# EAGLE design EMF-1 (EAGLE 5.11)
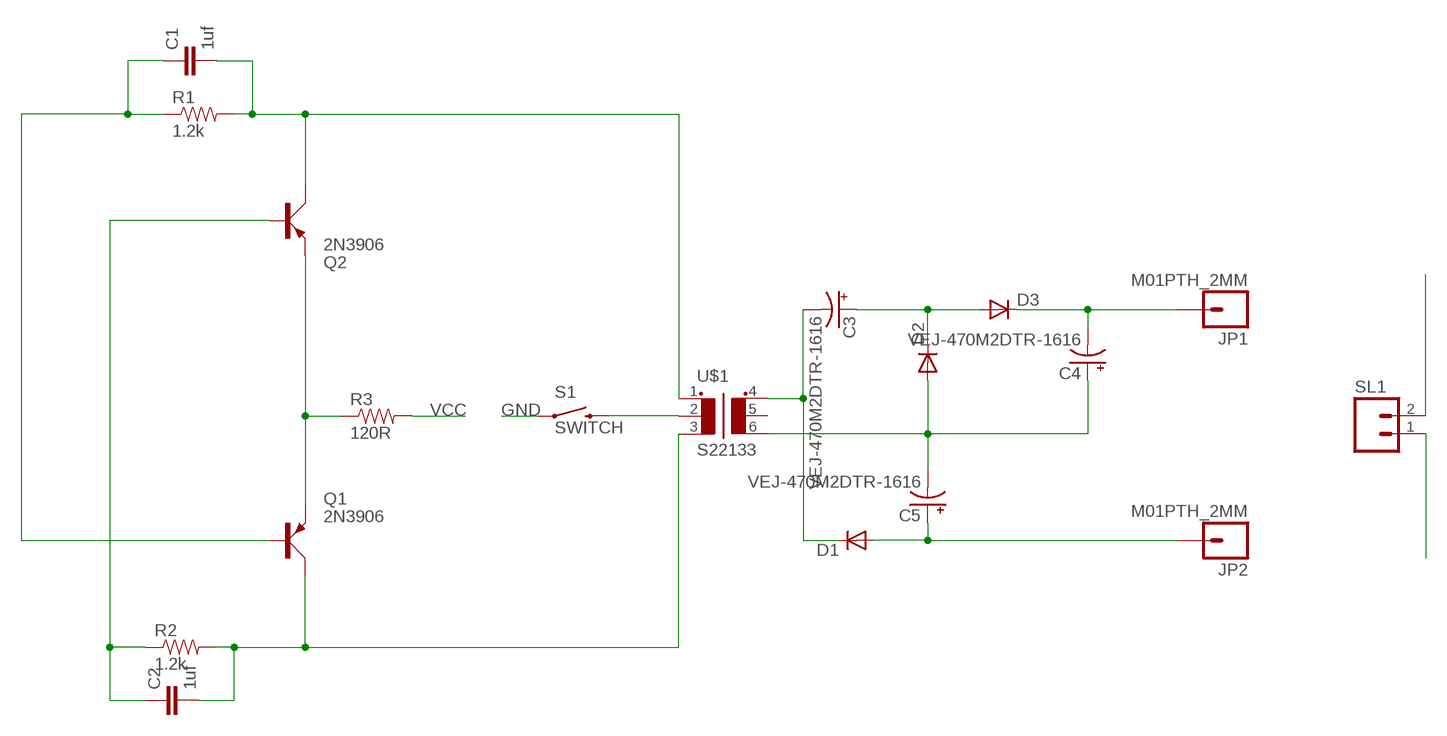
[diagram p0: schematic, sheet 1]

## Parts
C1  1uf  CAP0805  [0805]
C2  1uf  CAP0805  [0805]
C3  VEJ-470M2DTR-1616  CAP_POLPTH1  [CPOL-RADIAL-100UF-25V]
C4  VEJ-470M2DTR-1616  CAP_POLPTH1  [CPOL-RADIAL-100UF-25V]
C5  VEJ-470M2DTR-1616  CAP_POLPTH1  [CPOL-RADIAL-100UF-25V]
D1  DIODEHV  [DIODE-HV]
D2  DIODEHV  [DIODE-HV]
D3  DIODEHV  [DIODE-HV]
JP1  M01PTH_2MM  [1X01_2MM]
JP2  M01PTH_2MM  [1X01_2MM]
Q1  2N3906  [TO92D]
Q2  2N3906  [TO92D]
R1  1.2k  RESISTOR0805-RES  [0805]
R2  1.2k  RESISTOR0805-RES  [0805]
R3  120R  RESISTOR0805-RES  [0805]
S1  SWITCH  SWITCH-MOMENTARY-2PTH  [TACTILE-PTH]
SL1  M02  [02P]
U$1  S22133  [S22133]

## Nets
GND: S1.1 SL1.1
N$1: C1.1 Q1.B R1.1
N$2: C1.2 Q2.C R1.2 U$1.1
N$3: C2.2 Q1.C R2.2 U$1.3
N$4: C2.1 Q2.B R2.1
N$5: Q1.E Q2.E R3.1
N$6: S1.3 U$1.2
N$7: C3.2(-) D1.C U$1.4
N$8: C3.1(+) D2.C D3.A
N$9: C4.2(-) D3.C JP1.1
N$10: C4.1(+) C5.2(-) D2.A U$1.6
N$11: C5.1(+) D1.A JP2.1
VCC: R3.2 SL1.2
Unconnected: U$1.5

## Library data of the parts
C1 C2 = SparkFun:CAP: Capacitor Standard 0603 ceramic capacitor, and 0.1" leaded capacitor.
C3-C5 = SparkFun:CAP_POL: Capacitor Polarized These are standard SMD and PTH capacitors. Normally 10uF, 47uF, and 100uF in electrolytic and tantalum varieties. Always verify the external diameter of the through hole cap, it varies with capacity, voltage, and manufacturer. The EIA devices should be standard.
D1-D3 = SparkFun:DIODE: Diode These are standard reverse protection diodes and small signal diodes. SMA package can handle up to about 1A. SOD-323 can handle about 200mA. What the SOD-323 package when ordering, there are some mfgs out there that are 5-pin packages.
JP1 JP2 = SparkFun:M01: Header 1 Standard 1-pin 0.1" header. Use with straight break away headers (SKU : PRT-00116), right angle break away headers (PRT-00553), swiss pins (PRT-00743), machine pins (PRT-00117), and female headers (PRT-00115).
Q1 Q2 = transistor-small-signal:2N3906: PNP TRANSISTOR
R1-R3 = SparkFun:RESISTOR: Resistor Basic schematic elements and footprints for 0603, 1206, and PTH resistors.
S1 = SparkFun:SWITCH-MOMENTARY-2
SL1 = con-amp-quick:M02: AMP QUICK CONNECTOR; OC_FARNELL: unknown; OC_NEWARK: unknown
U$1 = EMF-1:S22133

## Board
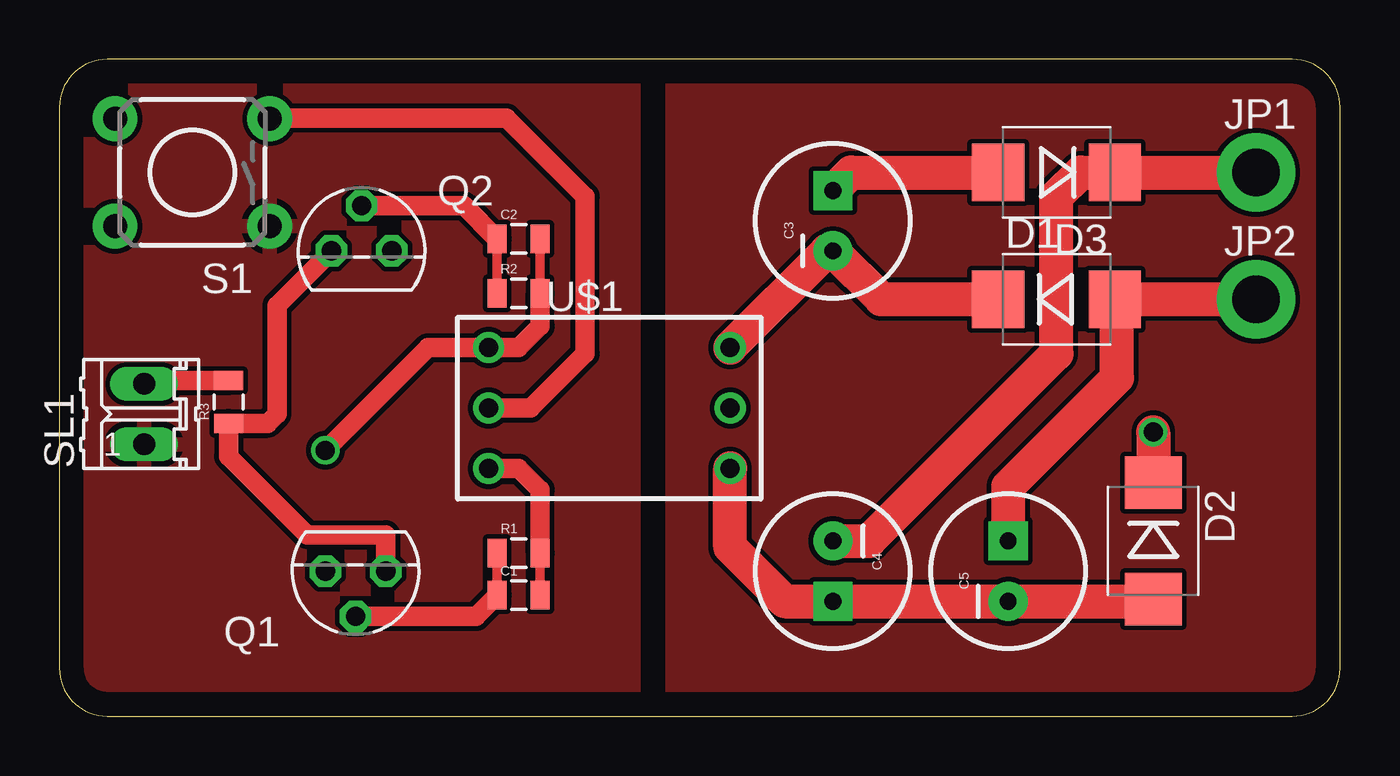
[diagram p1: board, top side]
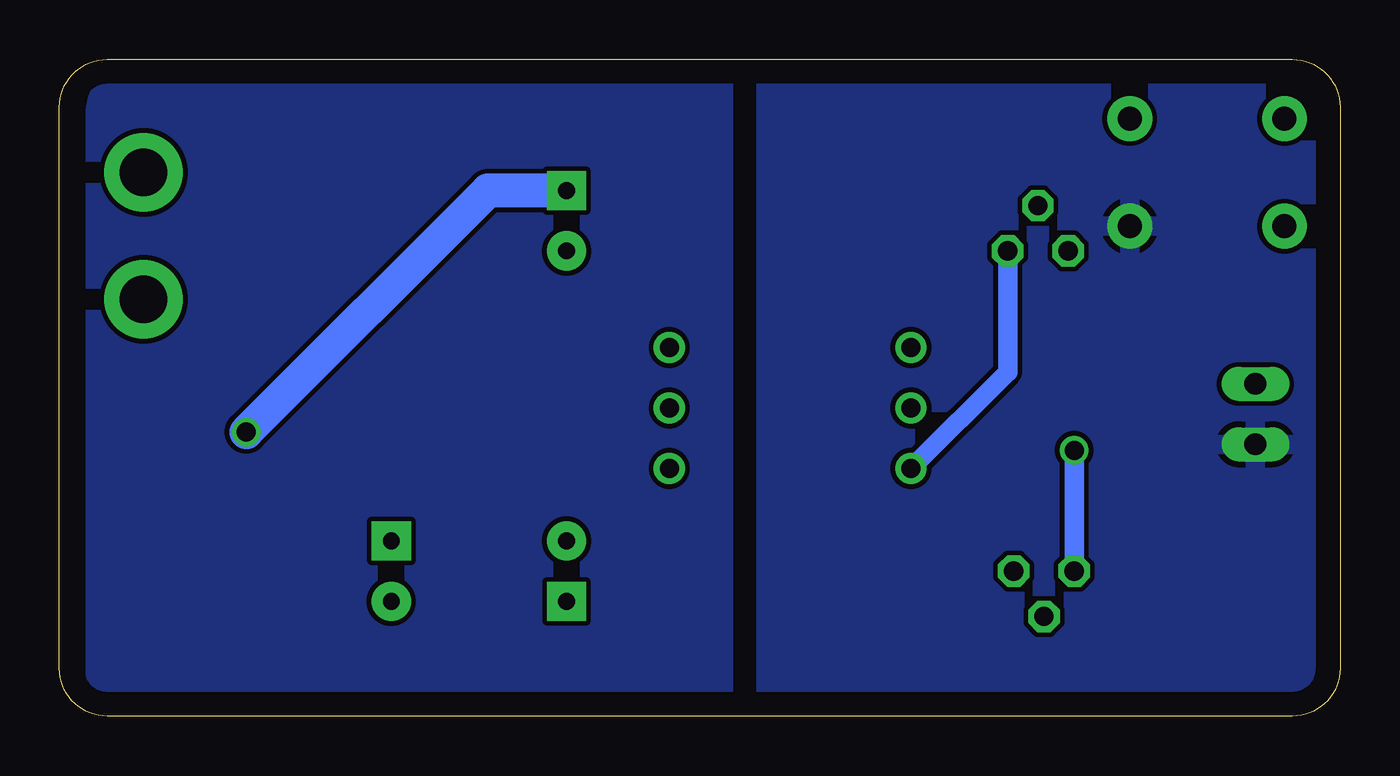
[diagram p2: board, bottom side, seen from below]

Size 53.83 x 27.61 mm. Coordinates in mm from the lower left corner, seen from the top.
Outline: 51.83,0 arc90 53.83,2 53.83,25.61 arc90 51.83,27.61 2,27.61 arc90 0,25.61 0,2 arc90 2,0 51.83,0
Copper layers (1*16): Top 0.035mm / dielectric 1.5mm / Bottom 0.035mm
Design rules "default": minimum track width 10mil, minimum drill 24mil, track to track 8mil, track to pad 8mil, pad to pad 8mil, via to via 8mil, smd to smd 8mil, copper to edge 40mil, drill to drill 8mil, minimum pad ring 10mil, minimum via ring 8mil, stop-mask expansion 4mil, vias tented up to drill 0mil, thermal gap 10mil

### Footprints (pad centres in the part's own frame; a part is rotated, then mirrored left to right if it is on the bottom)
0805 = smd 0.8 x 1.2: 1 -0.9,0; 2 0.9,0
CPOL-RADIAL-100UF-25V = drill 0.7 pad 1.651 square: 1 1.27,0 | drill 0.7 pad 1.651 round: 2 -1.27,0
DIODE-HV = smd 2.2 x 2.4: A 2.454,0; C -2.454,0
1X01_2MM = drill 2 pad 3.302 round: 1 0,0
TO92D = drill 0.813 octagon: B 0,1.905; C 1.27,0; E -1.27,0
TACTILE-PTH = drill 1.016 pad 1.88 round: 1 -3.251,2.261; 2 3.251,2.261; 3 -3.251,-2.261; 4 3.251,-2.261
02P = drill 0.914 long: 1 -1.27,0; 2 1.27,0
S22133 = drill 0.8 round: 1 -5.08,-2.54; 2 -5.08,0; 3 -5.08,2.54; 4 5.08,2.54; 5 5.08,0; 6 5.08,-2.54

### Placement (x,y rotation side)
C1  19.3,5.08 0 top
C2  19.3,20.07 0 top
C3  32.51,20.83 90 top
C4  32.51,6.1 270 top
C5  39.88,6.1 90 top
D1  41.91,17.53 0 top
D2  45.97,7.37 270 top
D3  41.91,22.86 180 top
JP1  50.29,22.86 0 top
JP2  50.29,17.53 0 top
Q1  12.45,6.1 180 top
Q2  12.7,19.56 0 top
R1  19.3,6.86 0 top
R2  19.3,17.78 0 top
R3  7.11,13.21 90 top
S1  5.59,22.86 180 top
SL1  3.56,12.7 90 top
U$1  23.11,12.95 0 top

### Tracks (layer width: path | path; a pad name or v marks a point on that pad's centre or on a via)
GND
  pour Top: -0.76,28.19 24.13,28.45 24.13,-0.51 -0.76,-0.76
  pour Bottom: 24.13,27.94 24.13,-1.27 -0.76,-1.27 -0.76,25.44 arc-90 1.74,27.94
N$1
  Top 0.406: C1.1 R1.1
  Top 0.813: Q1.B 17.52,4.19 C1.1
N$2
  Top 0.406: R1.2 C1.2
  Top 0.813: R1.2 20.2,9.51 19.3,10.41 U$1.1
  Bottom 0.813: U$1.1 13.97,14.48 Q2.C
N$3  (via drill 0.8)
  Top 0.406: R2.2 C2.2
  Top 0.813: R2.2 20.2,16.39 19.3,15.49 U$1.3 15.49,15.49 v11.18,11.18
  Bottom 0.813: Q1.C v11.18,11.18
N$4
  Top 0.406: C2.1 R2.1
  Top 0.813: Q2.B 17.01,21.46 C2.1
N$5
  Top 0.813: Q2.E 9.14,17.27 9.14,12.7 8.75,12.31 R3.1 7.11,10.92 10.41,7.62 13.72,7.62 13.72,7.11 Q1.E
N$6
  Top 0.813: S1.3 8.87,25.15 18.8,25.15 22.1,21.84 22.1,15.24 19.81,12.95 U$1.2
N$7
  Top 1.422: D1.C 34.54,17.53 C3.2 32.26,19.56 U$1.4
N$8  (via drill 0.8)
  Top 1.422: C3.1 33.27,22.86 D3.A | v45.97,11.94 D2.C
  Bottom 1.422: v45.97,11.94 35.81,22.1 C3.1
N$9
  Top 1.422: JP1.1 D3.C 42.93,22.86 41.91,21.84 41.91,15.24 34.04,7.37 C4.2
N$10
  Top 1.422: D2.A 45.89,4.83 C5.2 C4.1 30.48,4.83 28.19,7.11 U$1.6
N$11
  Top 1.422: JP2.1 D1.A 44.45,17.44 44.45,14.22 39.88,9.65 C5.1
N$12
  pour Bottom: 25.91,27.94 49.57,27.69 arc-90 52.32,25.44 52.32,-0.25 25.91,-0.25
N$13
  pour Top: 25.65,27.94 53.34,27.94 53.34,0 25.65,0
VCC
  Top 0.813: SL1.2 3.19,14.11 R3.2